# Altium schematic sheet Sheet05.SchDoc
size A4
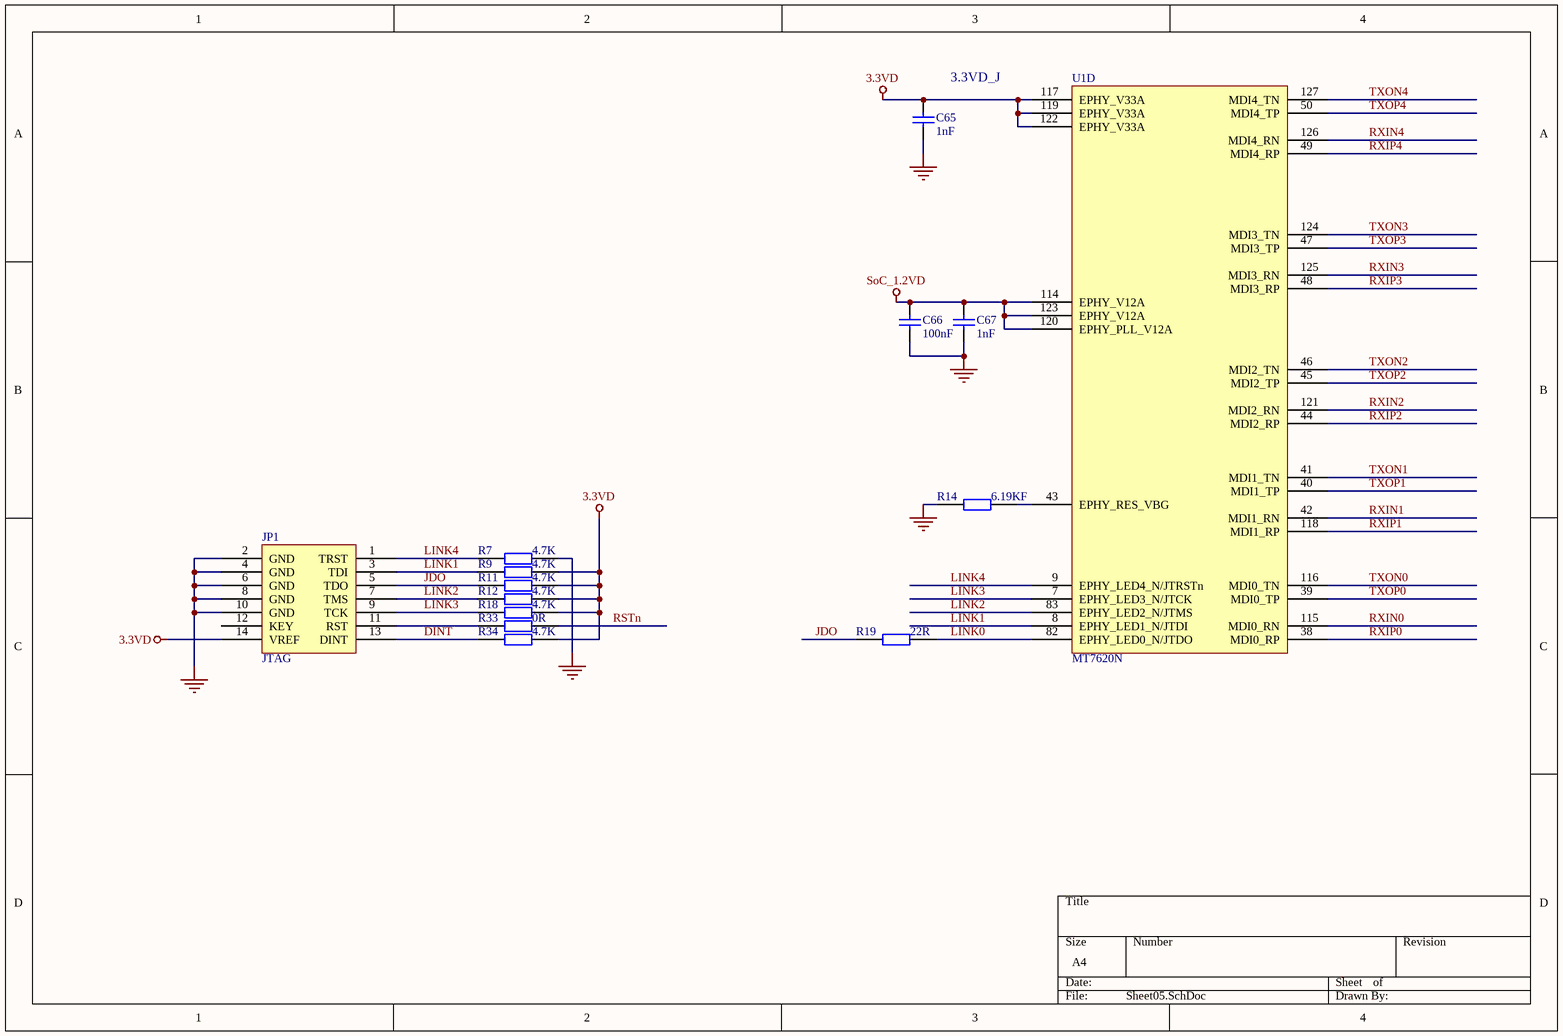
[diagram p0: Sheet05.SchDoc]

## Parts
C65  1nF  [R0402]
C66  100nF  [R0402]
C67  1nF  [R0402]
JP1  JTAG  [IDC-2X7-2_54-M]
R7  4.7K  [R0402]
R9  4.7K  [R0402]
R11  4.7K  [R0402]
R12  4.7K  [R0402]
R14  6.19KF  [R0402]
R18  4.7K  [R0402]
R19  22R  [R0402]
R33  0R  [R0402]
R34  4.7K  [R0402]
U1  MT7620N  [QFN-148-RT]  (part D of 5)

## Nets
3.3VD: C65.1 JP1.14(VREF) R9.1 R11.1 R12.1 R18.1 R34.1 U1.117(EPHY_V33A) U1.119(EPHY_V33A) U1.122(EPHY_V33A)
GND: C65.2 C66.2 C67.2 JP1.2(GND) JP1.4(GND) JP1.6(GND) JP1.8(GND) JP1.10(GND) R7.1 R14.2
SoC_1.2VD: C66.1 C67.1 U1.114(EPHY_V12A) U1.120(EPHY_PLL_V12A) U1.123(EPHY_V12A)
DINT: JP1.13(DINT) R34.2
JDO: JP1.5(TDO) R11.2 R19.2
LINK0: R19.1 U1.82(EPHY_LED0_N/JTDO)
LINK1: JP1.3(TDI) R9.2 U1.8(EPHY_LED1_N/JTDI)
LINK2: JP1.7(TMS) R12.2 U1.83(EPHY_LED2_N/JTMS)
LINK3: JP1.9(TCK) R18.2 U1.7(EPHY_LED3_N/JTCK)
LINK4: JP1.1(TRST) R7.2 U1.9(EPHY_LED4_N/JTRSTn)
RSTn: R33.1
RXIN0: U1.115(MDI0_RN)
RXIN1: U1.42(MDI1_RN)
RXIN2: U1.121(MDI2_RN)
RXIN3: U1.125(MDI3_RN)
RXIN4: U1.126(MDI4_RN)
RXIP0: U1.38(MDI0_RP)
RXIP1: U1.118(MDI1_RP)
RXIP2: U1.44(MDI2_RP)
RXIP3: U1.48(MDI3_RP)
RXIP4: U1.49(MDI4_RP)
TXON0: U1.116(MDI0_TN)
TXON1: U1.41(MDI1_TN)
TXON2: U1.46(MDI2_TN)
TXON3: U1.124(MDI3_TN)
TXON4: U1.127(MDI4_TN)
TXOP0: U1.39(MDI0_TP)
TXOP1: U1.40(MDI1_TP)
TXOP2: U1.45(MDI2_TP)
TXOP3: U1.47(MDI3_TP)
TXOP4: U1.50(MDI4_TP)
NetJP1_11: JP1.11(RST) R33.2
NetR14_1: R14.1 U1.43(EPHY_RES_VBG)

Not connected (* = marked no-connect by the designer): JP1 12(KEY)

## Notes on the sheet
- (near C65) 3.3VD_J

## Library data of the parts
C65-C67 = Cap Semi: 2pF, 50V, +/-0.25pF; Manufacturer: Generic Components; Class: Passive; SubClass: Capacitor; Value: 0.1uF; Published: 08/06/2000; Publisher: Altium Hobart Technology Centre
R7 R9 R11 R12 R14 R18 R19 R33 R34 = RES